# Altium schematic sheet DDS_Power_Supply.SchDoc
size A4; DrawnBy: Marin Sinožić; SheetNumber: 4; SheetTotal: 6
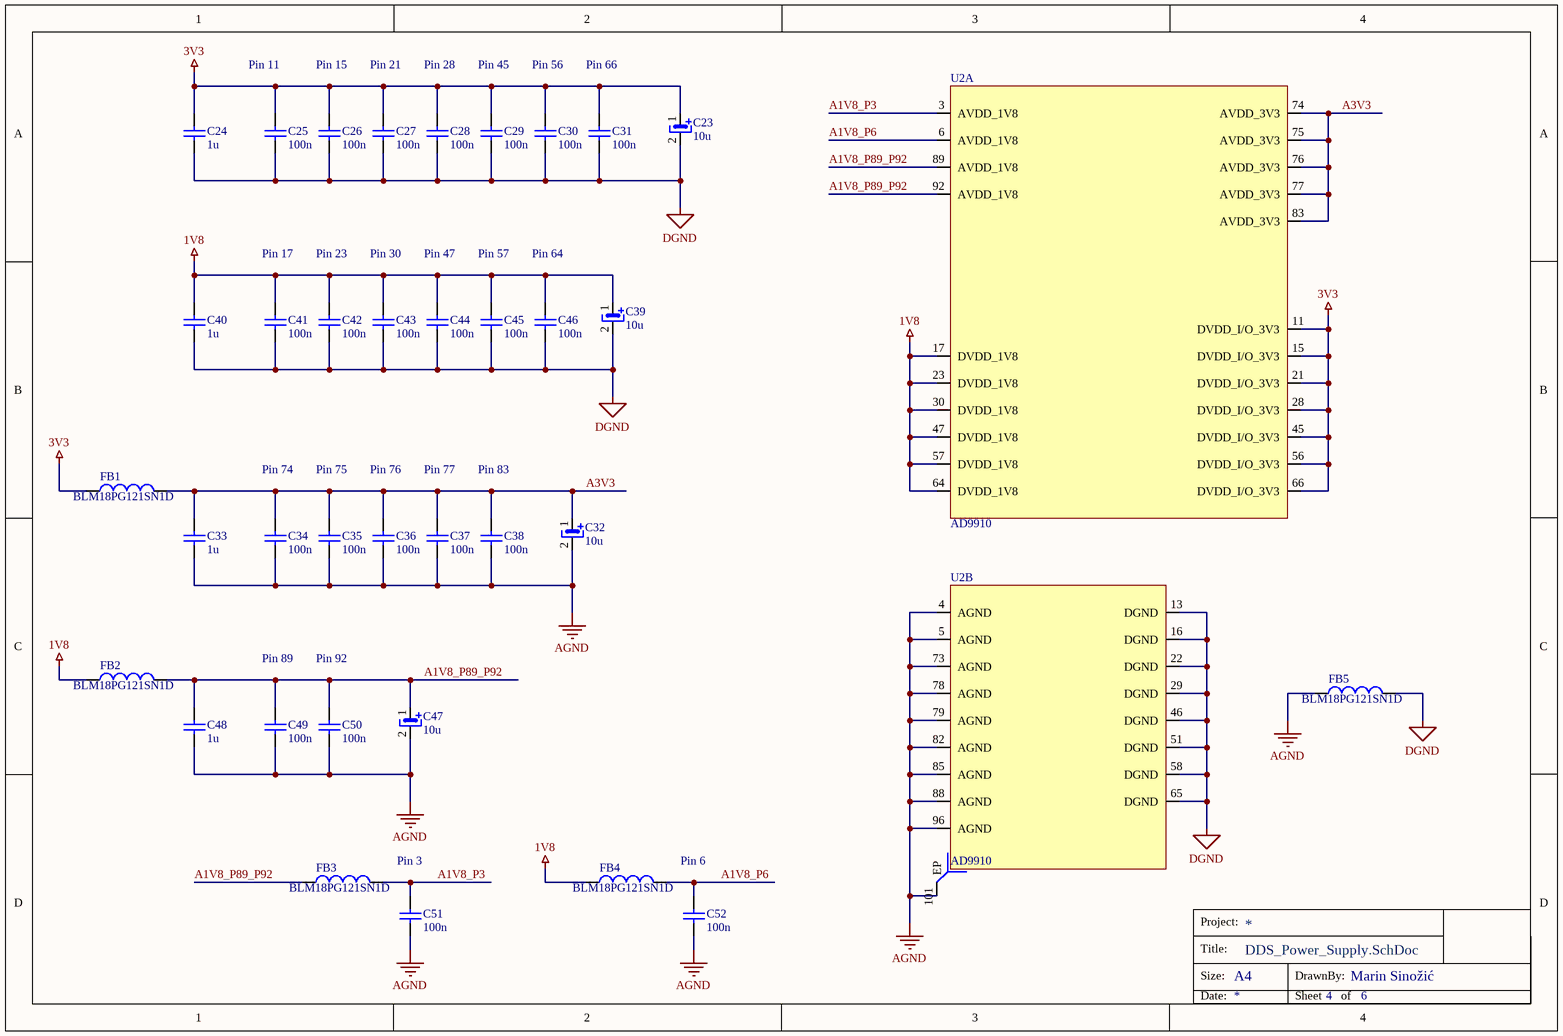
[diagram p0: DDS_Power_Supply.SchDoc]

## Parts
C23  10u  [0805]
C24  1u  [0805]
C25  100n  [0603]
C26  100n  [0603]
C27  100n  [0603]
C28  100n  [0603]
C29  100n  [0603]
C30  100n  [0603]
C31  100n  [0603]
C32  10u  [0805]
C33  1u  [0805]
C34  100n  [0603]
C35  100n  [0603]
C36  100n  [0603]
C37  100n  [0603]
C38  100n  [0603]
C39  10u  [0805]
C40  1u  [0805]
C41  100n  [0603]
C42  100n  [0603]
C43  100n  [0603]
C44  100n  [0603]
C45  100n  [0603]
C46  100n  [0603]
C47  10u  [0805]
C48  1u  [0805]
C49  100n  [0603]
C50  100n  [0603]
C51  100n  [0603]
C52  100n  [0603]
FB1  BLM18PG121SN1D  [0603]
FB2  BLM18PG121SN1D  [0603]
FB3  BLM18PG121SN1D  [0603]
FB4  BLM18PG121SN1D  [0603]
FB5  BLM18PG121SN1D  [0603]
U2  AD9910  [TSQFP50P1600X1600X105_HS-101N]  (parts A,B of 5)

## Nets
1V8: C39.1(+) C40.2 C41.2 C42.2 C43.2 C44.2 C45.2 C46.2 FB2.1 FB4.1 U2.17(DVDD_1V8) U2.23(DVDD_1V8) U2.30(DVDD_1V8) U2.47(DVDD_1V8) U2.57(DVDD_1V8) U2.64(DVDD_1V8)
3V3: C23.1(+) C24.2 C25.2 C26.2 C27.2 C28.2 C29.2 C30.2 C31.2 FB1.1 U2.11(DVDD_I/O_3V3) U2.15(DVDD_I/O_3V3) U2.21(DVDD_I/O_3V3) U2.28(DVDD_I/O_3V3) U2.45(DVDD_I/O_3V3) U2.56(DVDD_I/O_3V3) U2.66(DVDD_I/O_3V3)
AGND: C32.2(-) C33.1 C34.1 C35.1 C36.1 C37.1 C38.1 C47.2(-) C48.1 C49.1 C50.1 C51.1 C52.1 FB5.1 U2.4(AGND) U2.5(AGND) U2.73(AGND) U2.78(AGND) U2.79(AGND) U2.82(AGND) U2.85(AGND) U2.88(AGND) U2.96(AGND) U2.101(EP)
DGND: C23.2(-) C24.1 C25.1 C26.1 C27.1 C28.1 C29.1 C30.1 C31.1 C39.2(-) C40.1 C41.1 C42.1 C43.1 C44.1 C45.1 C46.1 FB5.2 U2.13(DGND) U2.16(DGND) U2.22(DGND) U2.29(DGND) U2.46(DGND) U2.51(DGND) U2.58(DGND) U2.65(DGND)
A1V8_P3: C51.2 FB3.2 U2.3(AVDD_1V8)
A1V8_P6: C52.2 FB4.2 U2.6(AVDD_1V8)
A1V8_P89_P92: C47.1(+) C48.2 C49.2 C50.2 FB2.2 FB3.1 U2.89(AVDD_1V8) U2.92(AVDD_1V8)
A3V3: C32.1(+) C33.2 C34.2 C35.2 C36.2 C37.2 C38.2 FB1.2 U2.74(AVDD_3V3) U2.75(AVDD_3V3) U2.76(AVDD_3V3) U2.77(AVDD_3V3) U2.83(AVDD_3V3)

## Notes on the sheet
- Pin 11
- Pin 15
- Pin 21
- Pin 28
- Pin 45
- Pin 56
- Pin 66
- Pin 17
- Pin 23
- Pin 30
- Pin 47
- Pin 57
- Pin 64
- Pin 74
- Pin 75
- Pin 76
- Pin 77
- Pin 83
- Pin 89
- Pin 92
- Pin 3
- Pin 6
- Project:
- Title:
- Size:
- A4
- DrawnBy:
- Date:
- Sheet
- of

## Library data of the parts
C23 C32 C39 C47 = C_TANT_10uF: CAP TANT 10UF 20% 10V 0805; Manufacturer Part Number: 718-2490-1-ND; Supplier 1: Digi-Key; Capacitance: 10uF; Price: 0.36; Value: 10u
C24 C33 C40 C48 = Cap: CAP CER 1UF 25V X5R 0805; Manufacturer Part Number: 311-1868-1-ND; Value: 1u; Supplier 1: Digi-Key; Price: 0.21
C25-C31 C34-C38 C41-C46 C49-C52 = Cap: CAP CER 0.1UF 50V X7R 0603; Manufacturer Part Number: 1276-CL10B104KB8WPNDCT-ND; Value: 100n; Supplier 1: Digi-Key; Price: 0.1
FB1-FB5 = FB_0603_120R@100MHz: FERRITE BEAD 120 OHM 0603 1LN; Manufacturer Part Number: 490-1037-1-ND; Supplier 1: Digi-Key; Price: 0.1
U2 = AD9910BSVZ: ANALOG DEVICES - AD9910BSVZ - Direct Digital Synthesizer, 1 GSPS. 14 Bit, 3.3 V,; Manufacturer Part Number: 505-AD9910BSVZ-ND; Price: 72.64; Supplier 1: Digi-Key